# EAGLE design untitled (EAGLE 9.6.2)
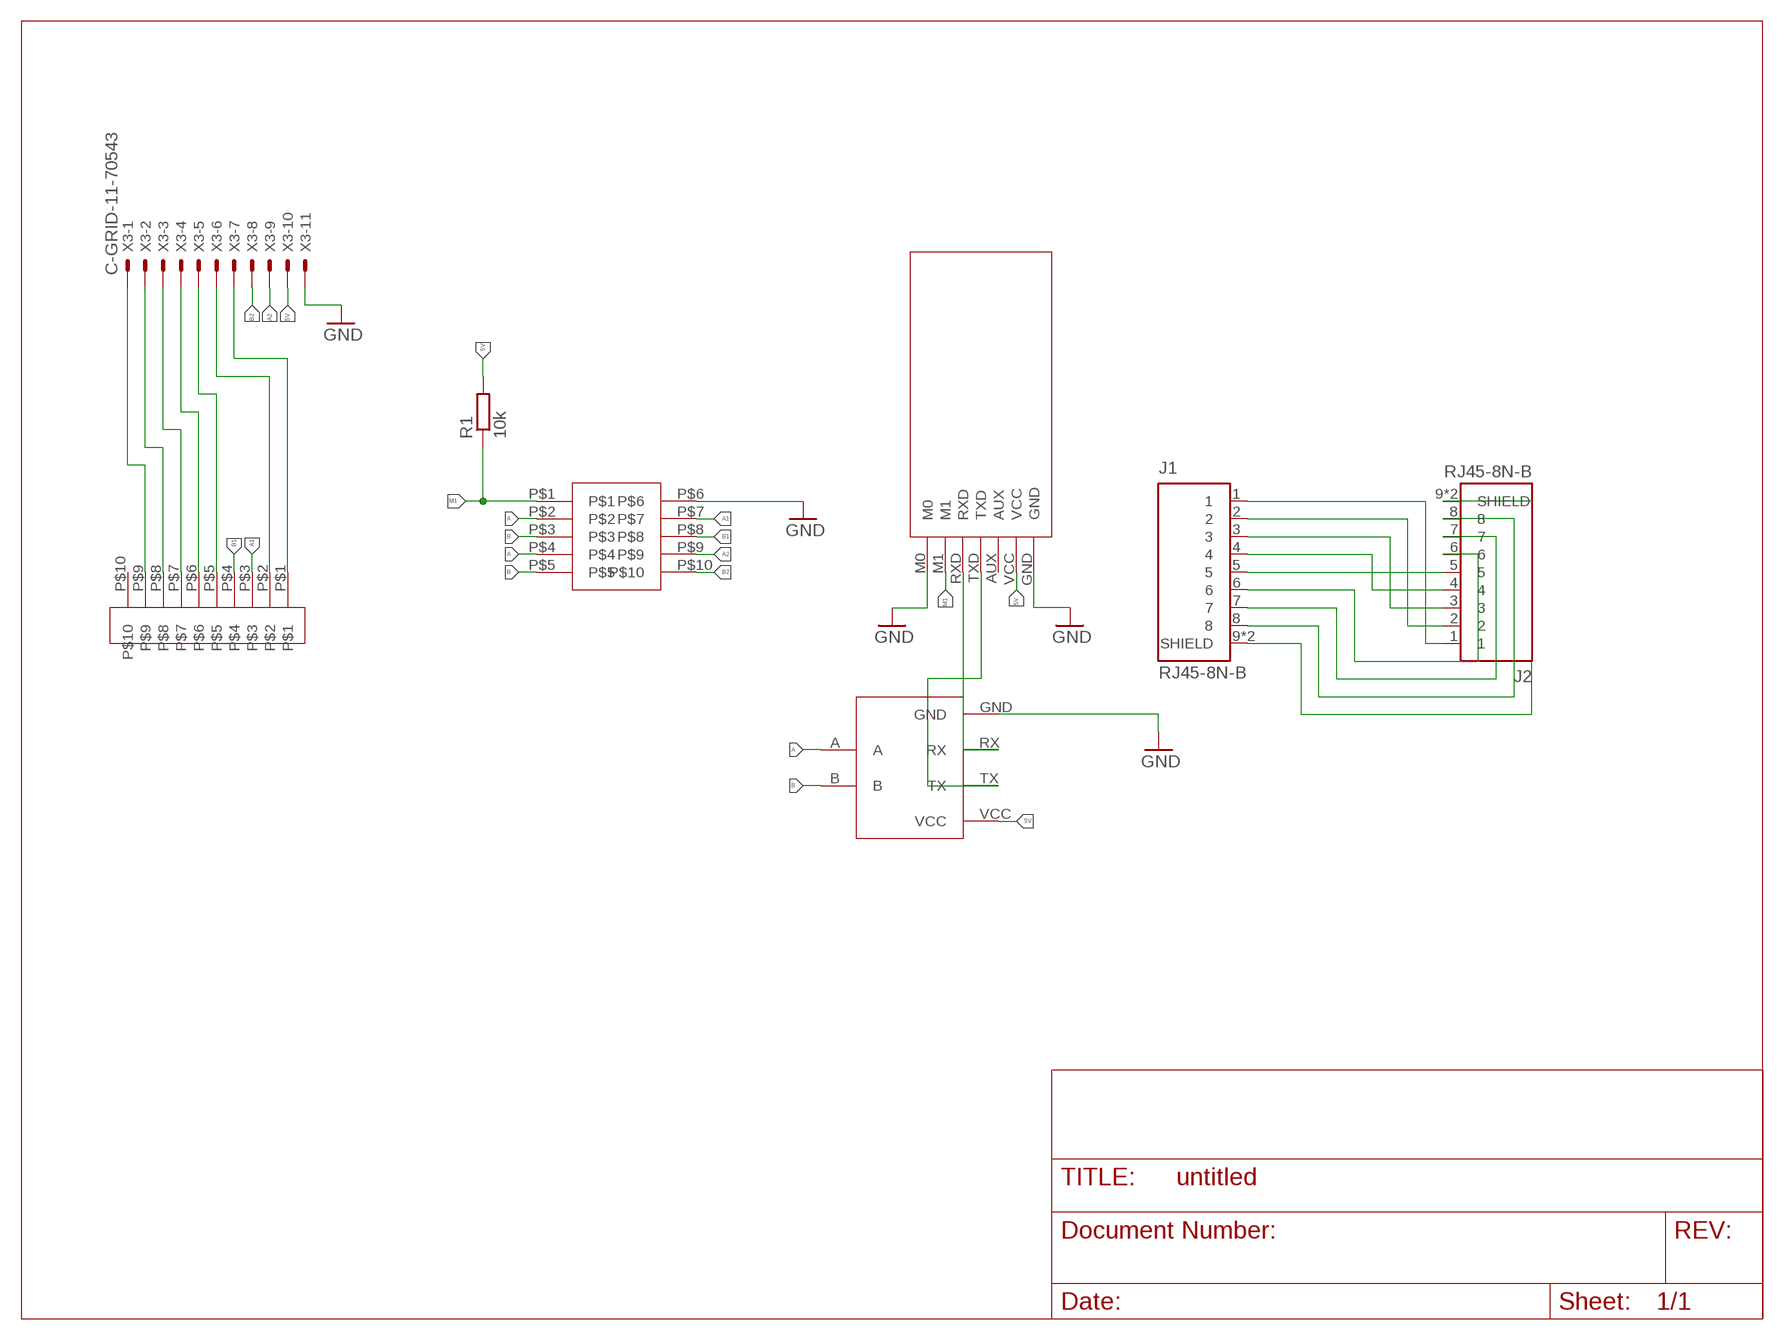
[diagram p0: schematic, sheet 1]

## Parts
DP-05RP1  DP-05RP  [DP-05RP]
EBYTEE220-900T22D1  EBYTEE220-900T22D  [EBYTEE220-900T22D]
J1  RJ45-8N-B  [TE_RJ45-8N-B]
J2  RJ45-8N-B  [TE_RJ45-8N-B]
KONEKTOR-3.81-13P1  KONEKTOR-3.81-13P  [KONEKTOR-3.81-13P]
R1  10k  R-EU_R0805  [R0805]
TTL-RS1  TTL-RS485  [TTL-RS485]
X3  C-GRID-11-70543  [70543-11]

## Nets
5V: EBYTEE220-900T22D1.VCC R1.2 TTL-RS1.VCC X3.10
A: DP-05RP1.P$2 DP-05RP1.P$4 TTL-RS1.A
A1: DP-05RP1.P$7 KONEKTOR-3.81-13P1.P$3
A2: DP-05RP1.P$9 X3.9
B: DP-05RP1.P$3 DP-05RP1.P$5 TTL-RS1.B
B1: DP-05RP1.P$8 KONEKTOR-3.81-13P1.P$4
B2: DP-05RP1.P$10 X3.8
GND: DP-05RP1.P$6 EBYTEE220-900T22D1.GND EBYTEE220-900T22D1.M0 TTL-RS1.GND X3.11
M1: DP-05RP1.P$1 EBYTEE220-900T22D1.M1 R1.1
N$1: KONEKTOR-3.81-13P1.P$1 X3.7
N$2: KONEKTOR-3.81-13P1.P$2 X3.6
N$3: EBYTEE220-900T22D1.RXD TTL-RS1.RX
N$4: EBYTEE220-900T22D1.TXD TTL-RS1.TX
N$7: KONEKTOR-3.81-13P1.P$5 X3.5
N$8: J1.1 J2.1
N$9: J1.2 J2.2
N$10: J1.3 J2.3
N$11: J1.4 J2.4
N$12: J1.5 J2.5
N$13: J1.6 J2.6
N$14: J1.7 J2.7
N$15: KONEKTOR-3.81-13P1.P$6 X3.4
N$16: KONEKTOR-3.81-13P1.P$7 X3.3
N$17: KONEKTOR-3.81-13P1.P$8 X3.2
N$18: KONEKTOR-3.81-13P1.P$9 X3.1
N$19: J1.8 J2.8
N$20: J1.9(SHIELD) J1.10(SHIELD) J2.9(SHIELD) J2.10(SHIELD)
Unconnected: EBYTEE220-900T22D1.AUX KONEKTOR-3.81-13P1.P$10

## Library data of the parts
DP-05RP1 = DP-05RP:DP-05RP
EBYTEE220-900T22D1 = EByte E220-900T22D:EBYTEE220-900T22D
J1 J2 = RJ45-8N-B:RJ45-8N-B: RJ Jack / Signal Line EMI/RFI Filters 6 TERM LOW PROFILE BLOCK INDUCTOR 8 PIN Check availability <https://pricing.snapeda.com/parts/RJ45-8N-B/TE%20Connectivity/view-part?ref=eda>; AVAILABILITY: In Stock; DESCRIPTION: Jack Modular Connector 8p8c (RJ45, Ethernet) 90° Angle (Right) Unshielded -; MF: TE Connectivity; MP: RJ45-8N-B; PACKAGE: None; PRICE: None; PURCHASE-URL: https://pricing.snapeda.com/search/part/RJ45-8N-B/?ref=eda
KONEKTOR-3.81-13P1 = KONEKTOR-3.81-13P:KONEKTOR-3.81-13P
R1 = rcl:R-EU_: RESISTOR, European symbol; SPICEPREFIX: R
TTL-RS1 = TTL-RS485:TTL-RS485
X3 = con-molex:C-GRID-11: CONNECTOR wire to board 2.54 mm (0.100") pitch header; MF: MOLEX; OC_FARNELL: unknown; OC_NEWARK: unknown

## Board
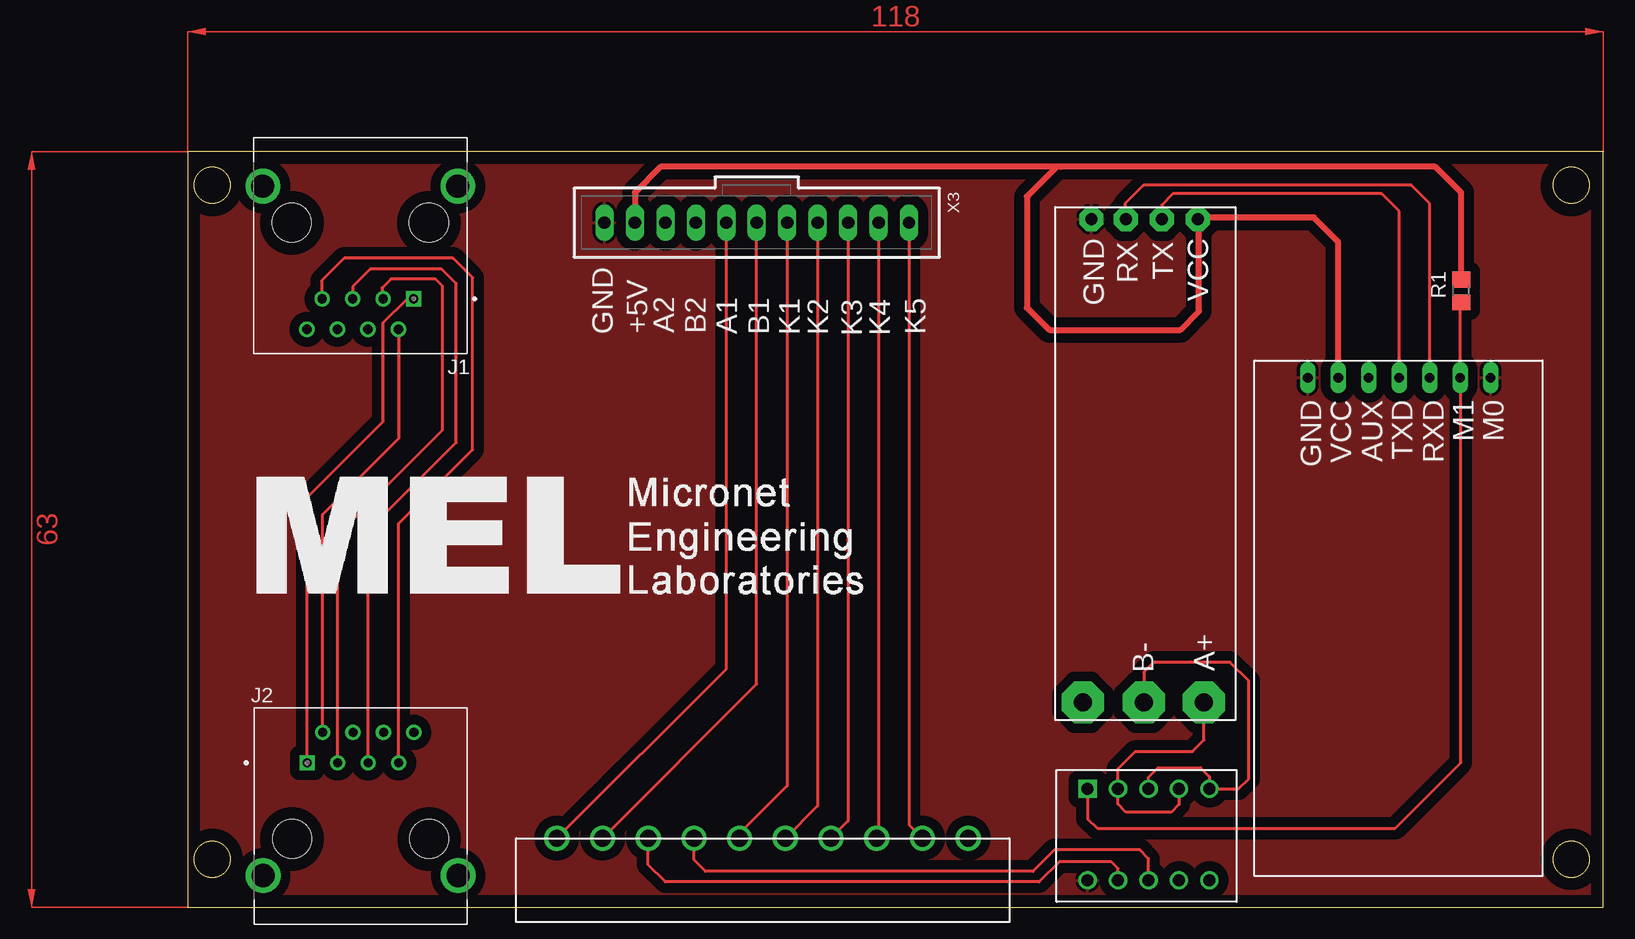
[diagram p1: board, top side]
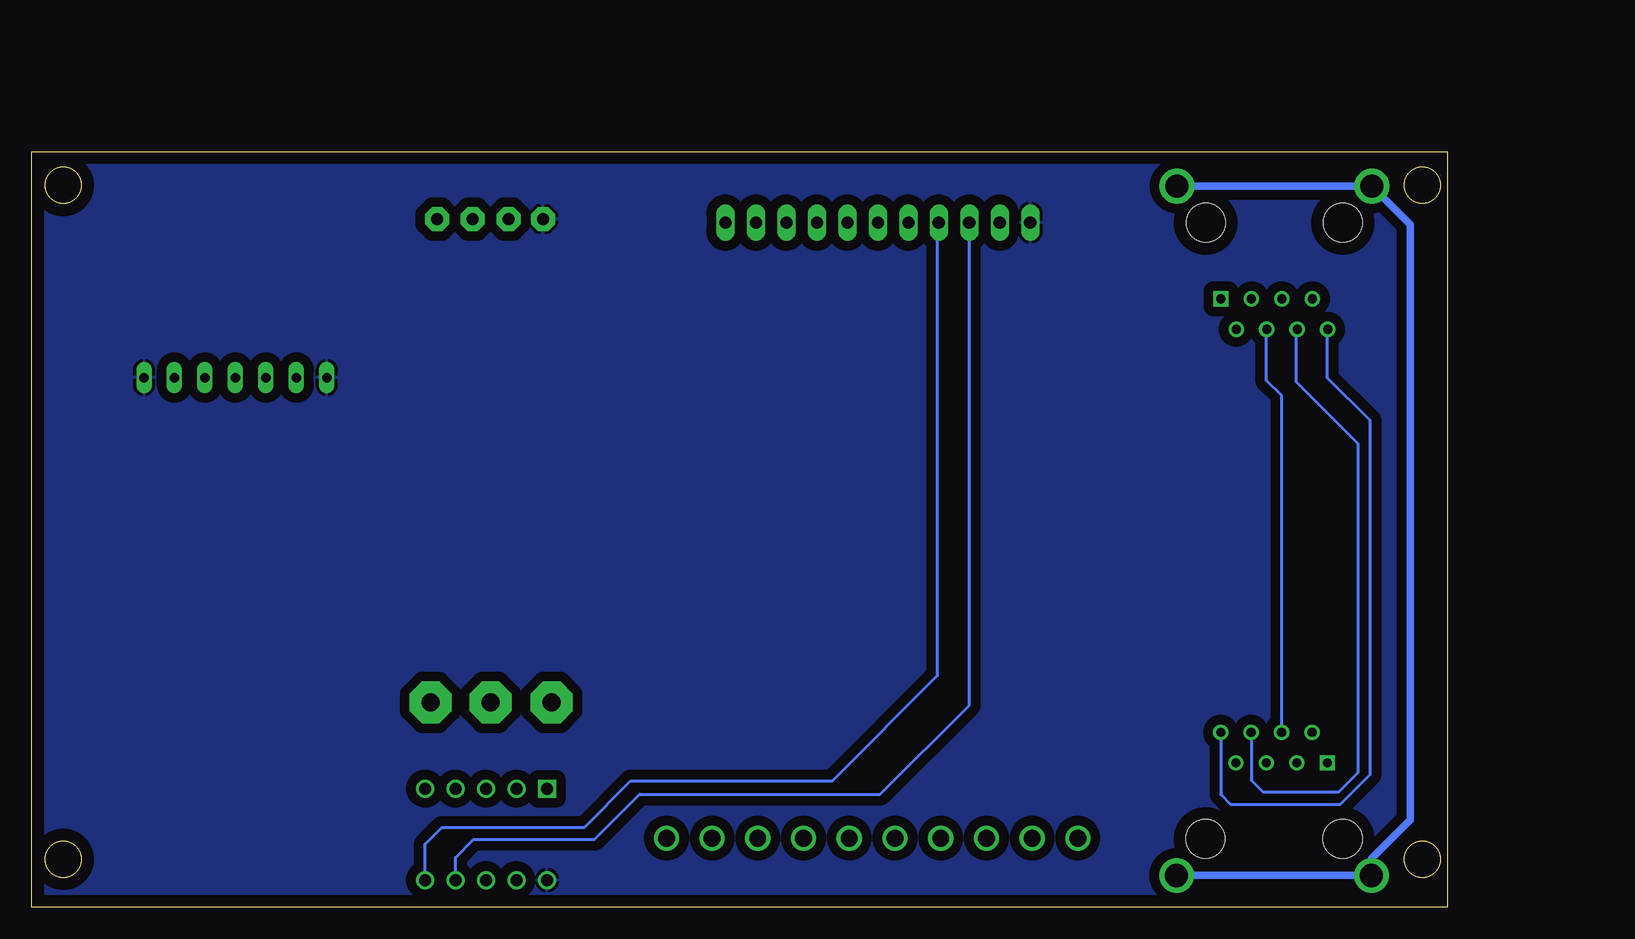
[diagram p2: board, bottom side, seen from below]

Size 118 x 63 mm. Coordinates in mm from the lower left corner, seen from the top.
Outline: 0,0 118,0 118,63 0,63 0,0
Outline: circle at 2.07,60.18 radius 1.5
Outline: circle at 2.07,3.99 radius 1.5
Outline: circle at 115.35,60.18 radius 1.5
Outline: circle at 115.35,3.99 radius 1.5
Copper layers (1*16): Top 0.035mm / dielectric 1.5mm / Bottom 0.035mm
Design rules "default": minimum track width 6mil, minimum drill 0.35mm, track to track 6mil, track to pad 6mil, pad to pad 6mil, via to via 6mil, smd to smd 6mil, copper to edge 40mil, drill to drill 6mil, minimum pad ring 10mil, minimum via ring 8mil, stop-mask expansion 4mil, vias tented up to drill 0mil, thermal gap 10mil

### Footprints (pad centres in the part's own frame; a part is rotated, then mirrored left to right if it is on the bottom)
DP-05RP = drill 1 square: P$1 2.6,13.431 | drill 1: P$2 5.14,13.431; P$3 7.68,13.431; P$4 10.22,13.431; P$5 12.76,13.431; P$6 2.6,5.811; P$7 5.14,5.811; P$8 7.68,5.811; P$9 10.22,5.811; P$10 12.76,5.811
EBYTEE220-900T22D = drill 0.8 pad 1.27 long: AUX -4.56,-10.98; GND -4.56,-16.06; M0 -4.56,-0.82; M1 -4.56,-3.36; RXD -4.56,-5.9; TXD -4.56,-8.44; VCC -4.56,-13.52
TE_RJ45-8N-B = drill 0.76 square: 1 -4.445,6.35 | drill 0.76: 2 -3.175,8.89; 3 -1.905,6.35; 4 -0.635,8.89; 5 0.635,6.35; 6 1.905,8.89; 7 3.175,6.35; 8 4.445,8.89 | drill 1.93: 9 -8.125,-3.05; 10 8.125,-3.05 | hole 3.25: -5.715,0; 5.715,0
KONEKTOR-3.81-13P = drill 1.4: P$1 -3.61,1.01; P$2 0.2,1.01; P$3 4.01,1.01; P$4 7.82,1.01; P$5 11.63,1.01; P$6 15.44,1.01; P$7 19.25,1.01; P$8 23.06,1.01; P$9 26.87,1.01; P$10 30.68,1.01
R0805 = smd 1.3 x 1.5: 1 -0.95,0; 2 0.95,0
TTL-RS485 = drill 1.5 pad 3.5 octagon: A -19.7,-6; B -19.7,-1; P$7 -19.7,4.1 | drill 1 pad 2 octagon: GND 20.6,3.37; RX 20.581,0.505; TX 20.583,-2.493; VCC 20.6,-5.47
70543-11 = drill 1.016 long: 1 -12.7,0; 2 -10.16,0; 3 -7.62,0; 4 -5.08,0; 5 -2.54,0; 6 0,0; 7 2.54,0; 8 5.08,0; 9 7.62,0; 10 10.16,0; 11 12.7,0

### Placement (x,y rotation side)
DP-05RP1  72.44,-3.56 0 top
EBYTEE220-900T22D1  109.45,39.58 270 top
J1  14.4,57.06 180 top
J2  14.43,5.68 0 top
KONEKTOR-3.81-13P1  34.4,4.74 0 top
R1  106.16,51.37 90 top
TTL-RS1  78.74,36.77 90 top
X3  47.45,57.07 180 top

### Tracks (layer width: path | path; a pad name or v marks a point on that pad's centre or on a via)
5V
  Top 0.508: 84.32,57.48 93.9,57.48 95.93,55.46 EBYTEE220-900T22D1.VCC | 84.32,57.48 TTL-RS1.VCC | R1.2 106.16,59.59 104.02,61.73 72.78,61.73 72.46,61.73 | 72.46,61.73 69.97,59.24 69.97,49.98 71.83,48.12 82.75,48.12 84.32,49.69 84.32,57.48 | 72.46,61.73 39.44,61.73 37.29,59.59 X3.10
A
  Top 0.254: DP-05RP1.P$4 82.66,8.56 82.01,7.91 78.24,7.91 77.55,8.59 77.55,9.85 DP-05RP1.P$2 77.58,11.54 79.01,12.97 83.78,12.97 84.74,13.93 TTL-RS1.A
A1
  Top 0.254: DP-05RP1.P$7 77.58,3.21 77.01,3.78 72.69,3.78 70.99,2.09 39.84,2.09 38.41,3.52 KONEKTOR-3.81-13P1.P$3
A2
  Bottom 0.254: DP-05RP1.P$9 82.66,4.12 81.14,5.64 71.07,5.64 67.31,9.41 47.26,9.41 39.83,16.83 X3.9
B
  Top 0.254: DP-05RP1.P$3 80.12,10.84 80.9,11.62 84.44,11.62 85.2,10.87 DP-05RP1.P$5 87.61,9.87 88.46,10.71 88.46,18.86 86.9,20.42 80.53,20.42 79.74,19.62 TTL-RS1.B
B1
  Top 0.254: DP-05RP1.P$8 80.12,4.04 79.4,4.76 72.25,4.76 70.48,2.98 43.18,2.98 42.22,3.95 KONEKTOR-3.81-13P1.P$4
B2
  Bottom 0.254: DP-05RP1.P$10 85.2,5.24 83.79,6.65 71.92,6.65 68.05,10.52 51.25,10.52 42.47,19.3 42.47,56.97 X3.8
GND
  pour Bottom (isolate 0.813): 0,63 118,63 118,0 0,0
  pour Top (isolate 0.813): 0,63 118,63 118,0 0,0
M1
  Top 0.254: R1.1 106.09,50.35 EBYTEE220-900T22D1.M1 106.15,44.08 106.15,12.04 100.67,6.55 75.86,6.55 75.04,7.38 DP-05RP1.P$1
N$1
  Top 0.254: KONEKTOR-3.81-13P1.P$1 44.91,19.87 X3.7
N$2
  Top 0.254: KONEKTOR-3.81-13P1.P$2 47.45,18.6 X3.6
N$3
  Top 0.254: EBYTEE220-900T22D1.RXD 103.55,58.64 102,60.19 79.69,60.19 78.15,58.65 78.15,57.43 TTL-RS1.RX
N$4
  Top 0.254: EBYTEE220-900T22D1.TXD 101.01,58.02 99.56,59.48 82.13,59.48 81.2,58.55 81.2,57.38 TTL-RS1.TX
N$7
  Top 0.254: KONEKTOR-3.81-13P1.P$5 46.02,6.13 49.99,10.1 X3.5
N$8
  Top 0.254: J2.1 9.98,34.16 16.32,40.49 16.32,48.71 18.31,50.71 J1.1
N$9
  Top 0.254: J2.2 11.25,32.73 17.62,39.1 17.62,48.12 J1.2
N$10
  Top 0.254: J2.3 12.52,31.04 21.26,39.77 21.26,51.79 20.68,52.37 16.97,52.37 16.21,51.61 16.21,50.81 J1.3
N$11
  Bottom 0.254: J2.4 13.79,42.65 15.05,43.9 15.05,48.16 J1.4
N$12
  Top 0.254: J2.5 15.06,31.39 22.39,38.72 22.39,52 21.2,53.19 15.22,53.19 13.77,51.73 J1.5
N$13
  Bottom 0.254: J2.6 16.33,10.58 15.35,9.6 9.03,9.6 7.42,11.22 7.42,38.63 12.56,43.77 12.56,48.1 J1.6
N$14
  Top 0.254: J2.7 17.6,31.98 23.77,38.14 23.77,52.47 22.13,54.11 13.07,54.11 11.18,52.22 11.18,50.76 J1.7
N$15
  Top 0.254: KONEKTOR-3.81-13P1.P$6 52.53,8.44 X3.4
N$16
  Top 0.254: 53.82,5.92 KONEKTOR-3.81-13P1.P$7 55.07,7.17 X3.3
N$17
  Top 0.254: X3.2 57.61,5.9 KONEKTOR-3.81-13P1.P$8
N$18
  Top 0.254: X3.1 60.15,6.86 KONEKTOR-3.81-13P1.P$9
N$19
  Bottom 0.254: J2.8 18.87,9.4 18.05,8.58 8.91,8.58 6.42,11.06 6.42,40.58 9.97,44.12 J1.8
N$20
  Bottom 0.61: J2.10 J2.9 6.3,4.03 3.05,7.28 3.05,56.88 J1.10 J1.9
(copper drawn outside any net)
  shapes: Top area x2

### Text on the board
tNames: GND | +5V | A2 | B2 | A1 | B1 | K1 | K2 | K3 | K4 | K5